# EAGLE design SmartCar ESP V3 (EAGLE 9.6.2)
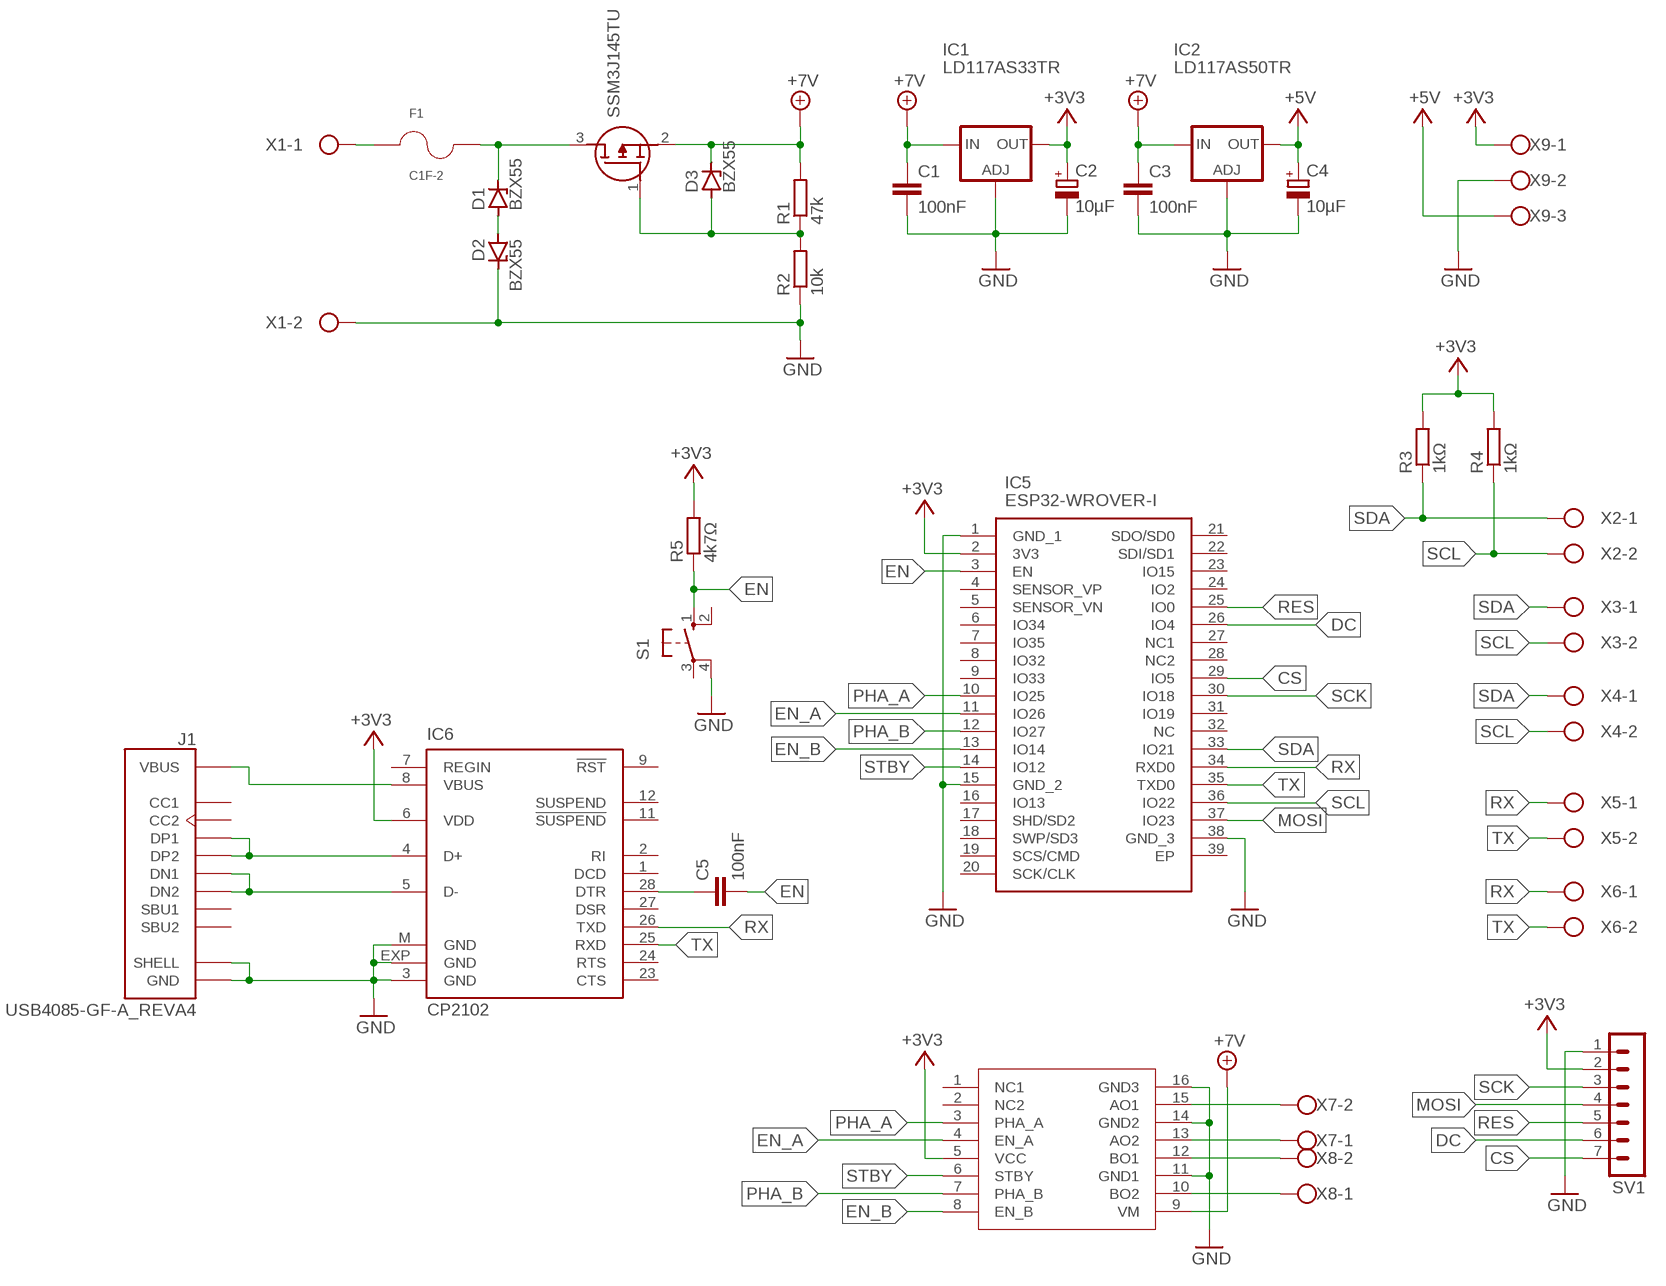
[diagram p0: schematic, sheet 1]

## Parts
C1  100nF  C-EUC0805  [C0805]
C2  10µF  CPOL-EUE2,5-6E  [E2,5-6E]
C3  100nF  C-EUC0805  [C0805]
C4  10µF  CPOL-EUE2,5-6E  [E2,5-6E]
C5  100nF  C-EUC0805  [C0805]
D1  BZX55  [DO35Z10]
D2  BZX55  [DO35Z10]
D3  BZX55  [DO35Z10]
F1  C1F-2  [FUSC3215X83N]
IC1  LD117AS33TR  [SOT223]
IC2  LD117AS50TR  [SOT223]
IC5  ESP32-WROVER-I  [ESP32WROVERI]
IC6  CP2102  [MLP28]
J1  USB4085-GF-A_REVA4  [GCT_USB4085-GF-A_REVA4]
R1  47k  R-EU_R0805  [R0805]
R2  10k  R-EU_R0805  [R0805]
R3  1kΩ  R-EU_R0805  [R0805]
R4  1kΩ  R-EU_R0805  [R0805]
R5  4k7Ω  R-EU_R0805  [R0805]
S1  10-XX  [B3F-10XX]
SV1  MA07-1  [MA07-1]
U$1  TC78H621FNG  [SOP65P640X110-16N]
U$2  SSM3J145TU  [SOTFL65P210X75-3N]
X1  W237-102  [W237-102]
X2  W237-102  [W237-102]
X3  W237-102  [W237-102]
X4  W237-102  [W237-102]
X5  W237-102  [W237-102]
X6  W237-102  [W237-102]
X7  W237-102  [W237-102]
X8  W237-102  [W237-102]
X9  W237-103  [W237-103]

## Nets
+3V3: C2.+ IC1.4(OUT) IC5.2(3V3) IC6.6(VDD) R3.2 R4.2 R5.2 SV1.2 U$1.5(VCC) X9.1
+5V: C4.+ IC2.4(OUT) X9.3
+7V: C1.1 C3.1 D3.C IC1.3(IN) IC2.3(IN) R1.2 U$1.9(VM) U$2.2(S)
CS: IC5.29(IO5) SV1.7
DC: IC5.26(IO4) SV1.6
EN: C5.2 IC5.3(EN) R5.1 S1.1(S)
EN_A: IC5.11(IO26) U$1.4(EN_A)
EN_B: IC5.13(IO14) U$1.8(EN_B)
GND: C1.2 C2.- C3.2 C4.- D2.C IC1.1(ADJ) IC2.1(ADJ) IC5.1(GND_1) IC5.15(GND_2) IC5.38(GND_3) IC6.3(GND) IC6.EXP(GND) IC6.M(GND) J1.A1(GND) J1.A12(GND) J1.B1(GND) J1.B12(GND) J1.P1(SHELL) J1.P2(SHELL) J1.P3(SHELL) J1.P4(SHELL) R2.1 S1.4(P1) SV1.1 U$1.11(GND1) U$1.14(GND2) U$1.16(GND3) X1.2 X9.2
MOSI: IC5.37(IO23) SV1.4
N$1: F1.1 X1.1
N$2: D1.A D2.A
N$3: D1.C F1.2 U$2.3(D)
N$4: IC6.5(D-) J1.A7(DN1) J1.B7(DN2)
N$5: IC6.4(D+) J1.A6(DP1) J1.B6(DP2)
N$6: C5.1 IC6.28(DTR)
N$7: D3.A R1.1 R2.2 U$2.1(G)
N$8: U$1.15(AO1) X7.2
N$9: U$1.13(AO2) X7.1
N$10: U$1.12(BO1) X8.2
N$11: U$1.10(BO2) X8.1
N$14: IC6.8(VBUS) J1.A4(VBUS) J1.A9(VBUS) J1.B4(VBUS) J1.B9(VBUS)
PHA_A: IC5.10(IO25) U$1.3(PHA_A)
PHA_B: IC5.12(IO27) U$1.7(PHA_B)
RES: IC5.25(IO0) SV1.5
RX: IC5.34(RXD0) IC6.26(TXD) X5.1 X6.1
SCK: IC5.30(IO18) SV1.3
SCL: IC5.36(IO22) R4.1 X2.2 X3.2 X4.2
SDA: IC5.33(IO21) R3.1 X2.1 X3.1 X4.1
STBY: IC5.14(IO12) U$1.6(STBY)
TX: IC5.35(TXD0) IC6.25(RXD) X5.2 X6.2
Unconnected: IC5.4(SENSOR_VP) IC5.5(SENSOR_VN) IC5.6(IO34) IC5.7(IO35) IC5.8(IO32) IC5.9(IO33) IC5.16(IO13) IC5.17(SHD/SD2) IC5.18(SWP/SD3) IC5.19(SCS/CMD) IC5.20(SCK/CLK) IC5.21(SDO/SD0) IC5.22(SDI/SD1) IC5.23(IO15) IC5.24(IO2) IC5.27(NC1) IC5.28(NC2) IC5.31(IO19) IC5.32(NC) IC5.39(EP) IC6.1(DCD) IC6.2(RI) IC6.7(REGIN) IC6.9(!RST) IC6.11(!SUSPEND) IC6.12(SUSPEND) IC6.23(CTS) IC6.24(RTS) IC6.27(DSR) J1.A5(CC1) J1.A8(SBU1) J1.B5(CC2) J1.B8(SBU2) S1.2(S1) S1.3(P) U$1.1(NC1) U$1.2(NC2)

## Library data of the parts
C1 C3 C5 = rcl:C-EU: CAPACITOR, European symbol; SPICEPREFIX: C
C2 C4 = rcl:CPOL-EU: POLARIZED CAPACITOR, European symbol; SPICEPREFIX: C
D1-D3 = diode:BZX55: Z DIODE
F1 = C1F-2:C1F-2: C1F 1 (0685F1000-01) | 1206 SMT Fuse | Fast Acting | 1A; A_MAX: 0.83; A_MIN: 0.83; A_NOM: 0.83; D_MAX: 3.4; D_MIN: 3.0; D_NOM: 3.2; E_MAX: 1.78; E_MIN: 1.38; E_NOM: 1.58; L1_MAX: 0.76; L1_MIN: 0.26; L1_NOM: 0.51; L_MAX: 0.76; L_MIN: 0.26; L_NOM: 0.51; MANUFACTURER: Bel Fuse Inc.; PARTREV: Jan2019; STANDARD: IPC 7351B
IC1 IC2 = v-reg:LD117A?*: Low drop fixed and adjustable positive voltage regulators 1 A Source: http://www.st.com/stonline/products/literature/ds/7194/ld1117axx.pdf
IC5 = ESP32-WROVER-I:ESP32-WROVER-I: WiFi Modules (802.11) SMD Module, ESP32-D0WDQ6, 64Mbits PSRAM, 32Mbits SPI flash, IPEX Antenna connector Source: Datasheet <https://www.mouser.es/datasheet/2/891/esp32-wrover_datasheet_en-1223875.pdf>; DESCRIPTION: WiFi Modules (802.11) SMD Module, ESP32-D0WDQ6, 64Mbits PSRAM, 32Mbits SPI flash, IPEX Antenna connector; HEIGHT: 3mm; MANUFACTURER_NAME: Espressif Systems; MANUFACTURER_PART_NUMBER: ESP32-WROVER-I; MOUSER_PART_NUMBER: 356-ESP32-WROVER-I
IC6 = silabs:CP210*: Single-Chip USB to UART Bridge Source: www.silabs.com .. CP2101.pdf / cp2102.pdf; MF: FARNELL; MPN: CP2102-GM; OC_FARNELL: 9282130; OC_NEWARK: 30K5635
J1 = USB4085-GF-A_REVA4:USB4085-GF-A_REVA4: USB 2.0 Type C Receptacle Dip Type, PCB Top Mount Check availability <https://pricing.snapeda.com/parts/USB4085-GF-A/Global%20Connector%20Technology/view-part?ref=eda>; AVAILABILITY: In Stock; DESCRIPTION: USB-C (USB TYPE-C) USB 2.0 Receptacle Connector 24 (16+8 Dummy) Position Through Hole, Right Angle, low cost, 3.46mm profile, 16 pin, horizontal, Top mount; MF: Global Connector Technology; MP: USB4085-GF-A; PACKAGE: None; PRICE: None; PURCHASE-URL: https://pricing.snapeda.com/search/part/USB4085-GF-A/?ref=eda
R1-R5 = rcl:R-EU_: RESISTOR, European symbol; SPICEPREFIX: R
S1 = switch-omron:10-XX: OMRON SWITCH; MPN: B3F-1000; OC_FARNELL: 176432; OC_NEWARK: 36M3542
SV1 = con-lstb:MA07-1: PIN HEADER; OC_FARNELL: unknown; OC_NEWARK: unknown
U$1 = TC78H621FNG:TC78H621FNG
U$2 = SSM3J145TU:SSM3J145TU
X1-X8 = con-wago-500:W237-102: WAGO SCREW CLAMP; MPN: 237-102; OC_FARNELL: unknown; OC_NEWARK: 70K9898
X9 = con-wago-500:W237-103: WAGO SCREW CLAMP; MPN: 237-103; OC_FARNELL: unknown; OC_NEWARK: 18M7116

## Board
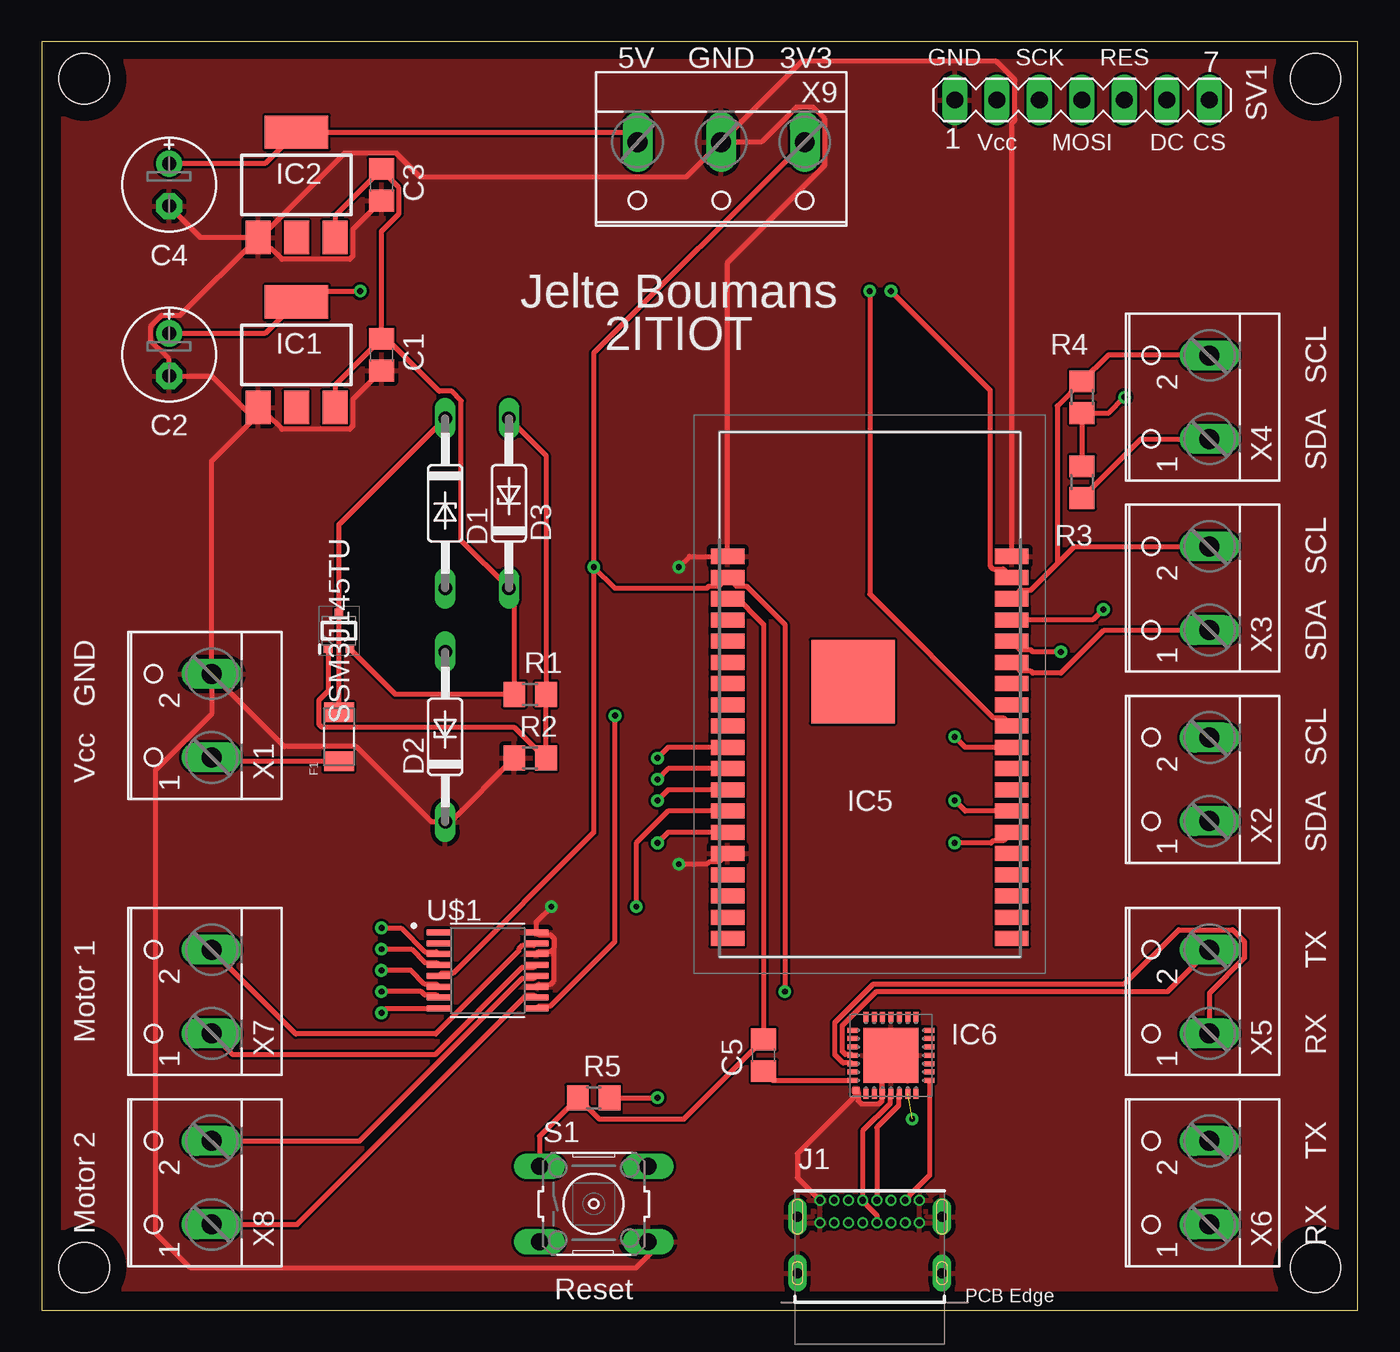
[diagram p1: board, top side]
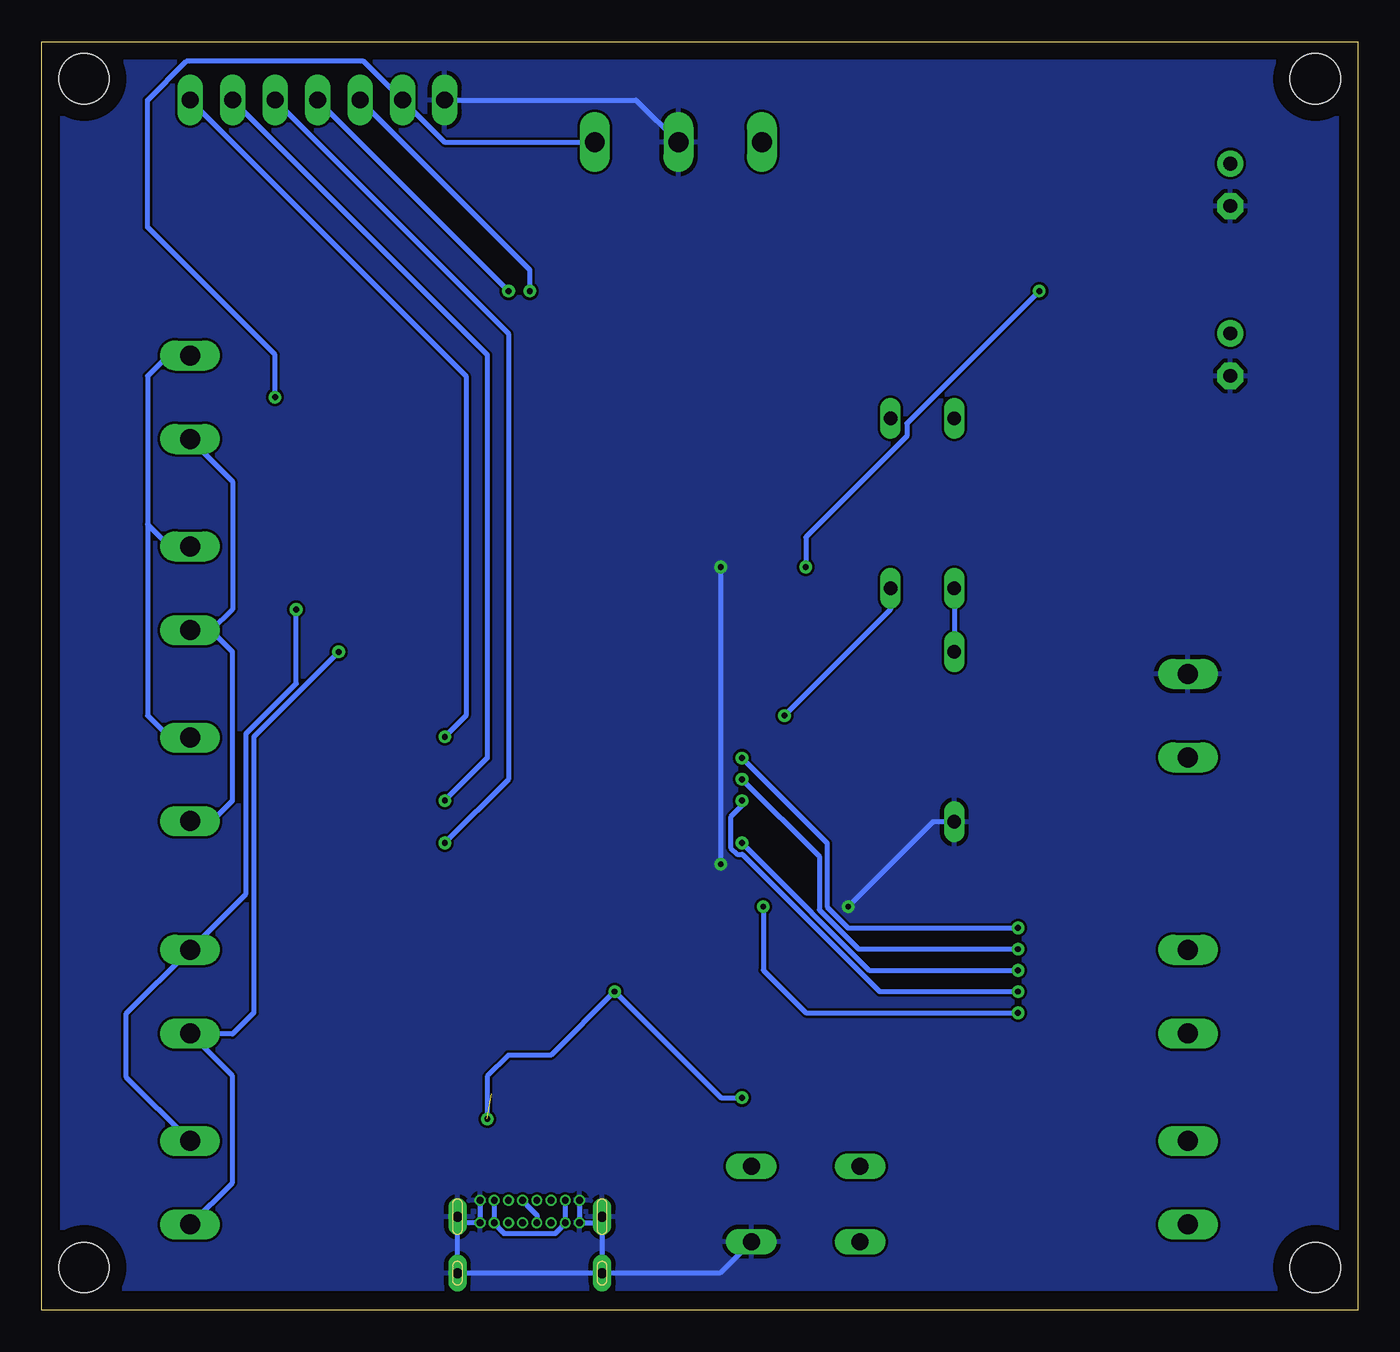
[diagram p2: board, bottom side, seen from below]

Size 78.72 x 75.87 mm. Coordinates in mm from the lower left corner, seen from the top.
Outline: 0,0 78.72,0 78.72,75.87 0,75.87 0,0
Copper layers (1*16): Top 0.035mm / dielectric 0.15mm / Bottom 0.035mm
Design rules "default *": minimum track width 6mil, minimum drill 0.35mm, track to track 6mil, track to pad 6mil, pad to pad 6mil, via to via 6mil, smd to smd 6mil, copper to edge 40mil, drill to drill 6mil, minimum pad ring 0mil, minimum via ring 8mil, stop-mask expansion 4mil, vias tented up to drill 0mil, thermal gap 10mil
Holes 3 mm at 2.54,2.54 2.54,73.66 76.2,2.54 76.2,73.66

### Footprints (pad centres in the part's own frame; a part is rotated, then mirrored left to right if it is on the bottom)
C0805 = smd 1.3 x 1.5: 1 -0.95,0; 2 0.95,0
E2,5-6E = drill 0.813 pad 1.575: + -1.27,0 | drill 0.813 pad 1.575 octagon: - 1.27,0
DO35Z10 = drill 0.813 long: A 5.08,0; C -5.08,0
FUSC3215X83N = smd 1.17 x 1.8: 1 -1.47,0; 2 1.47,0
SOT223 = smd 1.5 x 2: 1 -2.3,-3.15; 2 0,-3.15; 3 2.3,-3.15 | smd 3.8 x 2: 4 0,3.15
ESP32WROVERI = smd 2 x 0.9: 1 -8.5,8.26; 2 -8.5,6.99; 3 -8.5,5.72; 4 -8.5,4.45; 5 -8.5,3.18; 6 -8.5,1.91; 7 -8.5,0.64; 8 -8.5,-0.63; 9 -8.5,-1.9; 10 -8.5,-3.17; 11 -8.5,-4.44; 12 -8.5,-5.71; 13 -8.5,-6.98; 14 -8.5,-8.25; 15 -8.5,-9.52; 16 -8.5,-10.79; 17 -8.5,-12.06; 18 -8.5,-13.33; 19 -8.5,-14.6; 20 8.5,-14.6; 21 8.5,-13.33; 22 8.5,-12.06; 23 8.5,-10.79; 24 8.5,-9.52; 25 8.5,-8.25; 26 8.5,-6.98; 27 8.5,-5.71; 28 8.5,-4.44; 29 8.5,-3.17; 30 8.5,-1.9; 31 8.5,-0.63; 32 8.5,0.64; 33 8.5,1.91; 34 8.5,3.18; 35 8.5,4.45; 36 8.5,5.72; 37 8.5,6.99; 38 8.5,8.26 | smd 5 x 5: 39 -1,0.76
MLP28 = smd 0.6 x 0.3: 1 -2.3,1.5; 2 -2.3,1; 3 -2.3,0.5; 4 -2.3,0; 5 -2.3,-0.5; 6 -2.3,-1; 7 -2.3,-1.5; 15 2.3,-1.5; 16 2.3,-1; 17 2.3,-0.5; 18 2.3,0; 19 2.3,0.5; 20 2.3,1; 21 2.3,1.5 | smd 0.3 x 0.6: 8 -1.5,-2.3; 9 -1,-2.3; 10 -0.5,-2.3; 11 0,-2.3; 12 0.5,-2.3; 13 1,-2.3; 14 1.5,-2.3; 22 1.5,2.3; 23 1,2.3; 24 0.5,2.3; 25 0,2.3; 26 -0.5,2.3; 27 -1,2.3; 28 -1.5,2.3 | smd 3.3 x 3.3: EXP 0,0 | smd 0.435 x 0.435: M -2.103,2.103
GCT_USB4085-GF-A_REVA4 = drill 0.4 pad 0.65: A1 -2.975,4.025; A4 -2.125,4.025; A5 -1.275,4.025; A6 -0.425,4.025; A7 0.425,4.025; A8 1.275,4.025; A9 2.125,4.025; A12 2.975,4.025; B1 2.975,2.675; B4 2.125,2.675; B5 1.275,2.675; B6 0.425,2.675; B7 -0.425,2.675; B8 -1.275,2.675; B9 -2.125,2.675; B12 -2.975,2.675 | drill 0.6 pad 1.108 long: P1 -4.325,3.045; P2 4.325,3.045; P3 4.325,-0.335; P4 -4.325,-0.335
R0805 = smd 1.3 x 1.5: 1 -0.95,0; 2 0.95,0
B3F-10XX = drill 1.016 long: 1 -3.251,2.261; 2 3.251,2.261; 3 -3.251,-2.261; 4 3.251,-2.261
MA07-1 = drill 1.016 long: 1 -7.62,0; 2 -5.08,0; 3 -2.54,0; 4 0,0; 5 2.54,0; 6 5.08,0; 7 7.62,0
SOP65P640X110-16N = smd 1.49 x 0.4: 1 -2.915,2.275; 2 -2.915,1.625; 3 -2.915,0.975; 4 -2.915,0.325; 5 -2.915,-0.325; 6 -2.915,-0.975; 7 -2.915,-1.625; 8 -2.915,-2.275; 9 2.915,-2.275; 10 2.915,-1.625; 11 2.915,-0.975; 12 2.915,-0.325; 13 2.915,0.325; 14 2.915,0.975; 15 2.915,1.625; 16 2.915,2.275
SOTFL65P210X75-3N = smd 0.475 x 0.52: 1 -1.088,0.65; 2 -1.088,-0.65; 3 1.088,0
W237-102 = drill 1.194 long: 1 -2.5,-1.27; 2 2.5,-1.27
W237-103 = drill 1.194 long: 1 -5,-1.29; 2 0,-1.29; 3 5,-1.29

### Placement (x,y rotation side)
C1  20.32,57.15 270 top
C2  7.62,57.15 270 top
C3  20.32,67.31 270 top
C4  7.62,67.31 270 top
C5  43.18,15.24 90 top
D1  24.13,48.26 270 top
D2  24.13,34.29 90 top
D3  27.94,48.26 90 top
F1  17.78,34.29 90 top
IC1  15.24,57.15 0 top
IC2  15.24,67.31 0 top
IC5  49.53,36.83 0 top
IC6  50.8,15.24 90 top
J1  49.53,2.54 0 top
R1  29.21,36.83 180 top
R2  29.21,33.02 0 top
R3  62.23,49.53 90 top
R4  62.23,54.61 270 top
R5  33.02,12.7 0 top
S1  33.02,6.35 0 top
SV1  62.23,72.39 0 top
U$1  26.67,20.32 0 top
U$2  17.78,40.64 90 top
X1  8.89,35.56 90 top
X2  68.58,31.75 90 top
X3  68.58,43.18 90 top
X4  68.58,54.61 90 top
X5  68.58,19.05 90 top
X6  68.58,7.62 90 top
X7  8.89,19.05 90 top
X8  8.89,7.62 90 top
X9  40.64,68.58 180 top

### Tracks (layer width: path | path; a pad name or v marks a point on that pad's centre or on a via)
+3V3  (via drill 0.35)  (1 unrouted)
  Top 0.305: R3.2 R4.2 63.82,53.66 v64.77,54.61 | C2.+ 13.36,58.42 IC1.4 15.9,60.96 v19.05,60.96 | v33.02,44.45 34.29,43.18 39.78,43.18 39.9,43.3 40.52,43.3 IC5.2 41.55,43.3 42.16,43.3 44.45,41.01 v44.45,19.05 | X9.1 33.02,57.25 v33.02,44.45 | U$1.5 23.9,20.14 24.6,20.14 33.02,28.56 v33.02,44.45 | R5.2 v36.83,12.7
  Bottom 0.305: v19.05,60.96 26.98,53.03 26.98,52.28 33.02,46.23 v33.02,44.45 | v36.83,12.7 38.1,12.7 v44.45,19.05 48.26,15.24 50.8,15.24 52.07,13.97 v52.07,11.43 | X9.1 54.63,69.87 SV1.2 59.46,74.7 70.08,74.7 72.39,72.39 72.39,64.77 64.77,57.15 v64.77,54.61
+5V
  Top 0.305: C4.+ 13.36,68.58 IC2.4 35.05,70.46 X9.3
+7V  (via drill 0.35)
  Top 0.305: U$2.2 21.15,36.83 R1.2 28.26,42.86 D3.C 25.09,46.02 25.09,54.4 24.53,54.97 23.77,54.97 20.32,58.42 | IC1.3 17.54,55.32 C1.1 20.32,58.42 | IC2.3 17.54,65.48 C3.1 20.32,68.19 21.38,67.14 21.38,65.58 20.32,64.53 20.32,58.42 | U$1.9 29.73,18.19 30.43,18.19 34.29,22.05 v34.29,35.56
  Bottom 0.305: v34.29,35.56 27.94,41.91 D3.C
CS  (via drill 0.35)
  Top 0.305: IC5.29 55.24,33.66 v54.61,34.29
  Bottom 0.305: SV1.7 53.34,55.88 53.34,35.56 v54.61,34.29
DC  (via drill 0.35)
  Top 0.305: IC5.26 55.24,29.85 v54.61,30.48
  Bottom 0.305: SV1.6 52.07,57.15 52.07,33.02 v54.61,30.48
EN
  Top 0.305: IC5.3 41.34,42.86 43.18,41.01 C5.2 | S1.1 29.77,10.4 R5.1 33.34,11.43 38.42,11.43 C5.2 | 42.86,16.19 C5.2
EN_A  (via drill 0.35)
  Top 0.305: IC5.11 37.47,32.39 v36.83,31.75 | U$1.4 23.61,20.79 22.91,20.79 22.11,21.59 v20.32,21.59
  Bottom 0.305: v36.83,31.75 32.21,27.13 32.21,23.94 29.86,21.59 v20.32,21.59
EN_B  (via drill 0.35)
  Top 0.305: IC5.13 37.47,29.85 35.56,27.94 v35.56,24.13 | v20.32,17.78 20.59,18.05 U$1.8
  Bottom 0.305: v35.56,24.13 35.56,20.32 33.02,17.78 v20.32,17.78
GND  (via drill 0.35)
  Top 0.305: 51.8,13.7 52.07,13.97 IC6.EXP 50.3,14.74 50.3,13.97 | IC6.3 50.3,13.97 | IC6.M 48.84,12.99 | 48.84,12.99 48.84,12.51 49.02,12.34 50.08,12.34 50.26,12.51 50.26,13.93 50.3,13.97 | R2.1 24.45,29.21 D2.C 23.31,29.21 18.81,33.71 14.51,33.71 X1.2 | IC2.1 9.5,64.16 C4.- | 12.7,53.34 10.16,55.88 C2.- 7.62,56.88 6.53,57.97 6.53,58.87 7.17,59.51 8.29,59.51 IC2.1 | 12.7,53.34 12.94,53.58 | 12.94,53.58 IC1.1 | C1.2 18.59,54.48 18.59,52.87 18.42,52.7 14.36,52.7 13.48,53.58 12.94,53.58 | C3.2 18.59,64.64 18.59,63.03 18.42,62.85 14.36,62.85 13.72,63.5 12.7,63.5 12.7,63.92 IC2.1 | X1.2 10.16,50.8 12.7,53.34 | IC2.1 13.06,64.16 18.11,69.22 21.2,69.22 22.64,67.78 38.54,67.78 X9.2 | X9.2 43.05,69.87 45.14,71.97 46.14,71.97 46.84,71.26 46.84,68.48 41.03,62.67 IC5.1 38.74,45.09 v38.1,44.45 | IC5.38 58.03,71 58.22,71.19 58.22,73.59 57.11,74.7 45.47,74.7 X9.2 | 30.64,21.65 30.64,22.24 30.43,22.45 29.73,22.45 U$1.16 29.59,23.23 v30.48,24.13 | 30.64,21.65 30.43,21.44 29.73,21.44 U$1.14 | 30.64,21.65 30.64,19.7 30.43,19.49 29.73,19.49 U$1.11 | X1.2 10.16,35.65 6.79,32.29 6.79,4.62 8.88,2.54 35.56,2.54 36.83,3.81 36.55,4.09 S1.4 | IC5.15 40.52,26.8 39.9,26.8 39.78,26.67 v38.1,26.67 | 48.84,12.99 45.2,9.35 45.2,7.92 J1.A1
  Bottom 0.305: SV1.1 43.18,72.39 40.64,69.85 X9.2 | D2.C 25.4,29.21 v30.48,24.13 | v38.1,26.67 v38.1,44.45 | S1.4 38.16,2.21 J1.P4 | J1.P4 J1.P1 45.58,5.21 J1.B12 J1.A1 | J1.P4 45.72,2.21 J1.P3 J1.P2 53.48,5.21 J1.B1 J1.A12
  pour Top: 1.27,74.93 1.27,1.27 77.47,1.27 77.47,74.93
  pour Bottom: 1.27,74.93 1.27,1.27 77.47,1.27 77.47,74.93
MOSI  (via drill 0.35)
  Top 0.305: IC5.37 57.52,44.34 56.9,44.34 56.73,44.51 56.73,55.03 v50.8,60.96
  Bottom 0.305: SV1.4 v50.8,60.96
N$1
  Top 0.305: F1.1 10.4,32.82 X1.1
N$2
  Bottom 0.305: D1.A D2.A
N$3
  Top 0.305: F1.2 U$2.3 17.78,46.99 D1.C
N$4
  Top 0.305: IC6.5 51.26,12.9 51.26,12.22 49.95,10.92 J1.A7
  Bottom 0.305: J1.A7 49.73,6.34 49.73,6.3 49.1,5.67 J1.B7
N$5
  Top 0.305: IC6.4 50.76,12.9 50.76,12.37 49.1,10.72 J1.A6 49.33,6.34 49.33,6.3 49.95,5.67 J1.B6
N$6
  Top 0.305: C5.1 43.73,13.74 IC6.28
N$7
  Top 0.305: D3.A 30.16,51.12 R1.1 R2.2 30.09,33.02 28.24,34.87 16.75,34.87 16.57,35.05 16.57,36.47 17.13,37.03 U$2.1
N$8
  Top 0.305: U$1.15 29.44,21.8 28.74,21.8 28.54,21.59 28.54,21.48 23.57,16.51 15.2,16.51 X7.2
N$9
  Top 0.305: U$1.13 29.44,20.5 28.74,20.5 23.52,15.28 11.43,15.28 X7.1
N$10
  Top 0.305: U$1.12 29.44,19.85 28.74,19.85 19.01,10.12 X8.2
N$11
  Top 0.305: X8.1 15.28,5.12 29,18.84 29.44,18.84 U$1.10
N$14
  Top 0.305: J1.A9 51.88,6.79 51.88,6.83 53.1,8.05 IC6.8
  Bottom 0.305: J1.A4 J1.B9 47.62,5 47.62,4.95 47.99,4.58 51.07,4.58 51.44,4.95 51.44,5 J1.B4 J1.A9
PHA_A  (via drill 0.35)
  Top 0.305: IC5.10 37.47,33.66 v36.83,33.02 | U$1.3 23.61,21.44 22.91,21.44 21.49,22.86 v20.32,22.86
  Bottom 0.305: v36.83,33.02 31.75,27.94 31.75,24.13 30.48,22.86 v20.32,22.86
PHA_B  (via drill 0.35)
  Top 0.305: IC5.12 37.47,31.12 v36.83,30.48 | U$1.7 23.61,18.84 22.91,18.84 22.7,19.05 v20.32,19.05
  Bottom 0.305: v36.83,30.48 36.83,30.18 37.51,29.49 37.51,27.66 37.11,27.26 36.82,27.26 28.61,19.05 v20.32,19.05
RES  (via drill 0.35)
  Top 0.305: IC5.25 57.52,28.07 56.9,28.07 56.78,27.94 v54.61,27.94
  Bottom 0.305: SV1.5 50.8,58.42 50.8,31.75 v54.61,27.94
RX  (via drill 0.35)
  Top 0.305: IC6.26 48.46,14.78 47.93,14.78 47.44,15.27 47.44,17.21 49.74,19.51 64.77,19.51 68.01,22.75 71.24,22.75 71.94,22.05 71.94,21.05 69.85,18.96 X5.1 | v60.96,39.37 59.28,39.37 59.16,39.49 58.55,39.49 IC5.34
  Bottom 0.305: X6.1 69.81,5.12 67.31,7.62 67.31,14.01 X5.1 69.85,16.51 67.31,16.51 66.04,17.78 66.04,34.29 v60.96,39.37
SCK  (via drill 0.35)
  Top 0.305: IC5.30 57.52,35.45 56.9,35.45 49.53,42.82 v49.53,60.96
  Bottom 0.305: SV1.3 49.53,62.23 v49.53,60.96
SCL
  Top 0.305: IC5.36 58.55,43.06 59.16,43.06 60.75,44.66 | 60.75,44.66 61.77,45.68 X3.2 | X4.2 69.85,57.15 63.82,57.15 R4.1 60.75,54.08 60.75,44.66
  Bottom 0.305: X4.2 71.16,57.11 72.39,55.88 72.39,46.99 | X3.2 71.08,45.68 72.39,46.99 | 72.39,46.99 72.39,35.56 71.08,34.25 X2.2
SDA
  Top 0.305: IC5.33 58.55,38.23 59.16,38.23 59.28,38.1 60.96,38.1 63.54,40.68 X3.1 | R3.1 65.76,52.11 X4.1
  Bottom 0.305: X4.1 67.31,49.57 67.31,41.91 68.58,40.64 | 68.58,40.64 69.81,40.64 X3.1 | X2.1 68.54,29.25 67.31,30.48 67.31,39.37 68.58,40.64
STBY  (via drill 0.35)
  Top 0.305: IC5.14 37.47,28.58 v36.83,27.94 | U$1.6 23.61,19.49 22.91,19.49 22.08,20.32 v20.32,20.32
  Bottom 0.305: v36.83,27.94 32.66,23.77 32.66,23.75 29.23,20.32 v20.32,20.32
TX  (via drill 0.35)
  Top 0.305: IC6.25 48.45,15.29 48.07,15.29 47.9,15.46 47.9,17.02 49.93,19.05 67.35,19.05 X5.2 | v63.5,41.91 62.87,41.28 IC5.35
  Bottom 0.305: X6.2 73.66,13.93 73.66,17.74 X5.2 66.5,24.9 66.5,34.48 63.5,37.48 v63.5,41.91

### Text on the board
tNames: 5V | GND | 3V3 | GND | SCK | RES | Vcc | MOSI | DC | CS | Jelte Boumans | 2ITIOT | SCL | SDA | SCL | SDA | GND | SCL | Vcc | SDA | TX | Motor 1 | RX | TX | Motor 2 | RX | Reset